# Altium schematic sheet 同向100倍放大.SchDoc
size A4
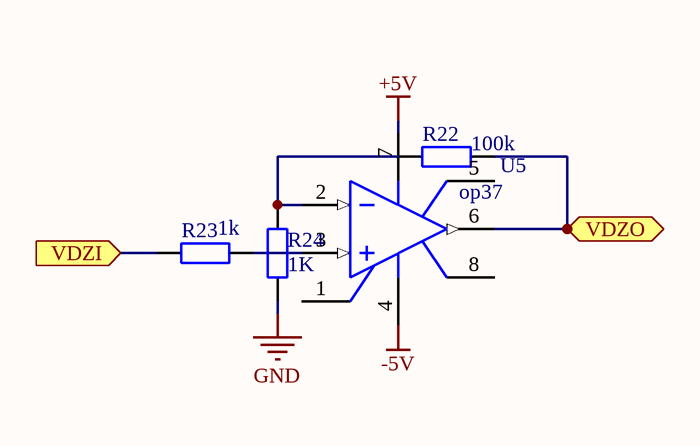
[diagram p0: 同向100倍放大.SchDoc]

## Parts
R22  value 100k  [AXIAL-0.4]  (hidden comment: Res2)
R23  value 1k  [AXIAL-0.4]  (hidden comment: Res2)
R24  value 1K  [AXIAL-0.4]  (hidden comment: Res2)
U5  op37  [N-8_A]

## Ports
VDZI (in), VDZO (out)

## Nets
+5V: U5.7(V+)
-5V: U5.4(V-)
GND: R24.1
VDZI: R23.1 ; port VDZI
VDZO: R22.2 U5.6(OUT) ; port VDZO
NetR22_1: R22.1 R24.2 U5.2(IN-)
NetR23_2: R23.2 U5.3(IN+)

Not connected (* = marked no-connect by the designer): U5 1(NULL1) 5(NC) 8(NULL2)

## Notes on the sheet
- 标题
- 日期
- 红外数字模拟接收一体机
- 2015 5 29
- 作者
- 模电组
- 单位
- 电子技术协会

## Library data of the parts
R22-R24 = Res2: Resistor; Published: 8-Jun-2000; LatestRevisionDate: 17-Jul-2002; LatestRevisionNote: Re-released for DXP Platform.; PackageReference: AXIAL-0.4; Publisher: Altium Limited
U5 = ADOP07CN: Ultra-Low Offset Voltage Operational Amplifier; Note: Pin 5 is not connected.; Published: 8-Jun-2000; LatestRevisionDate: 04-Mar-2005; LatestRevisionNote: Stylized 3D Model Added.; DatasheetVersion: 1992; PackageReference: N-8_A; Publisher: Altium Limited; PackageDescription: DIP; 8 Leads; Row Spacing 7.62 mm; Pitch 2.54 mm; Code_JEDEC: MO-001-AN; ComponentLink1Description: Manufacturer Link; ComponentLink1URL: http://www.analog.com/